# Altium schematic sheet gtp.SchDoc
size A
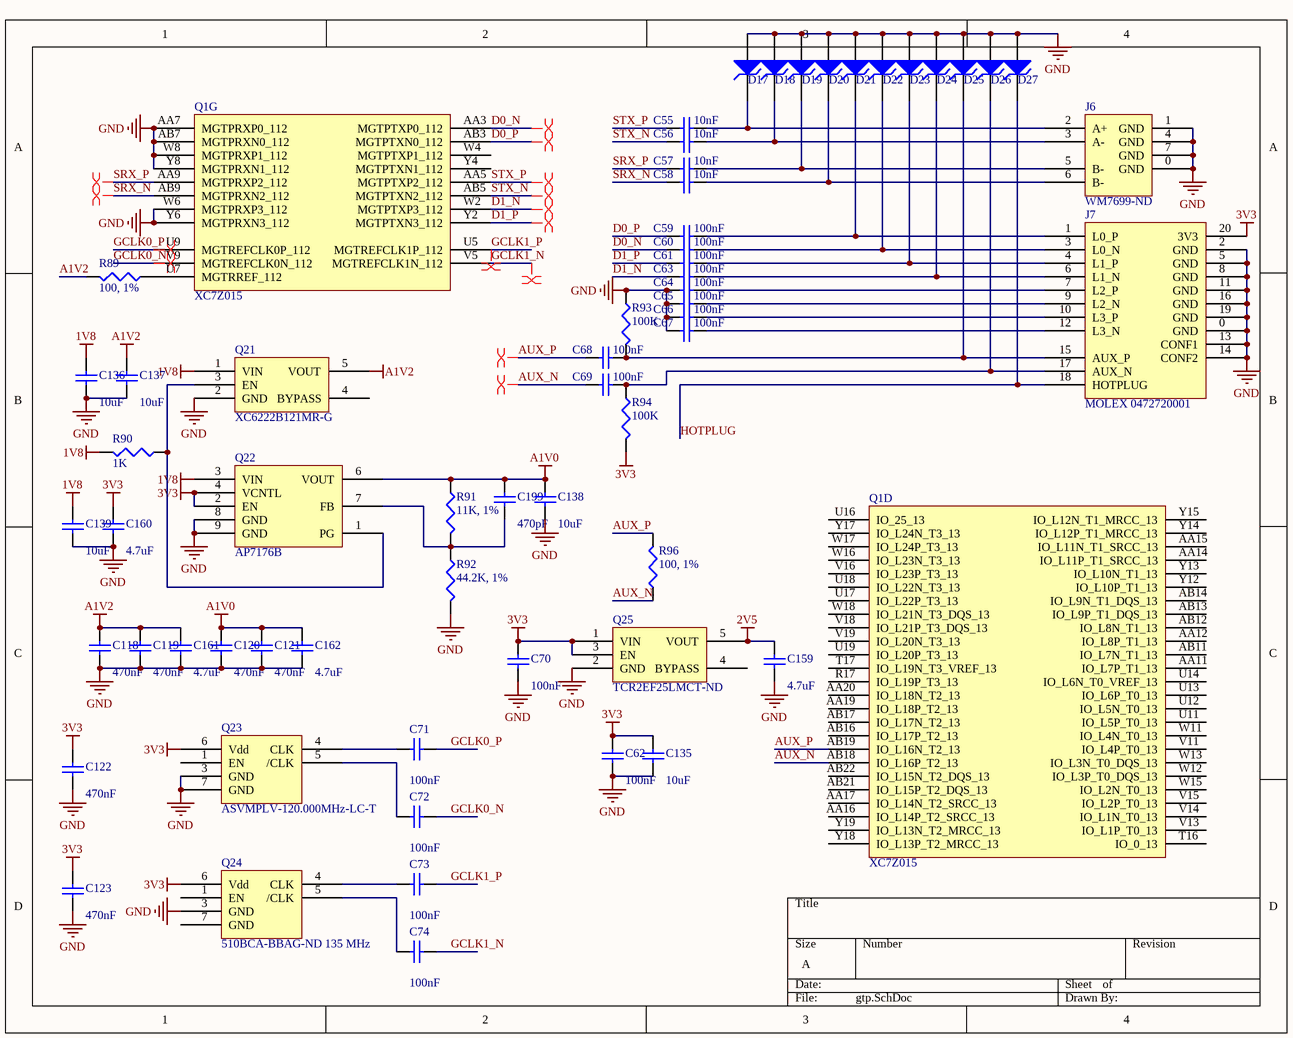
[diagram p0: gtp.SchDoc]

## Parts
C55  value 10nF  [CAPC1005X06L]  (hidden comment: Cap)
C56  value 10nF  [CAPC1005X06L]  (hidden comment: Cap)
C57  value 10nF  [CAPC1005X06L]  (hidden comment: Cap)
C58  value 10nF  [CAPC1005X06L]  (hidden comment: Cap)
C59  value 100nF  [CAPC1005X06L]  (hidden comment: Cap)
C60  value 100nF  [CAPC1005X06L]  (hidden comment: Cap)
C61  value 100nF  [CAPC1005X06L]  (hidden comment: Cap)
C62  value 100nF  [CAPC1005X06L]  (hidden comment: Cap)
C63  value 100nF  [CAPC1005X06L]  (hidden comment: Cap)
C64  value 100nF  [CAPC1005X06L]  (hidden comment: Cap)
C65  value 100nF  [CAPC1005X06L]  (hidden comment: Cap)
C66  value 100nF  [CAPC1005X06L]  (hidden comment: Cap)
C67  value 100nF  [CAPC1005X06L]  (hidden comment: Cap)
C68  value 100nF  [CAPC1005X06L]  (hidden comment: Cap)
C69  value 100nF  [CAPC1005X06L]  (hidden comment: Cap)
C70  value 100nF  [CAPC1005X06L]  (hidden comment: Cap)
C71  value 100nF  [CAPC1005X06L]  (hidden comment: Cap)
C72  value 100nF  [CAPC1005X06L]  (hidden comment: Cap)
C73  value 100nF  [CAPC1005X06L]  (hidden comment: Cap)
C74  value 100nF  [CAPC1005X06L]  (hidden comment: Cap)
C118  value 470nF  [CAPC1005X06L]  (hidden comment: JMK105BJ474KV-F)
C119  value 470nF  [CAPC1005X06L]  (hidden comment: JMK105BJ474KV-F)
C120  value 470nF  [CAPC1005X06L]  (hidden comment: JMK105BJ474KV-F)
C121  value 470nF  [CAPC1005X06L]  (hidden comment: JMK105BJ474KV-F)
C122  value 470nF  [CAPC1005X06L]  (hidden comment: JMK105BJ474KV-F)
C123  value 470nF  [CAPC1005X06L]  (hidden comment: JMK105BJ474KV-F)
C135  value 10uF  [CAPC1608X90N]  (hidden comment: GRM188R60G106ME47)
C136  value 10uF  [CAPC1608X90N]  (hidden comment: GRM188R60G106ME47)
C137  value 10uF  [CAPC1608X90N]  (hidden comment: GRM188R60G106ME47)
C138  value 10uF  [CAPC1608X90N]  (hidden comment: GRM188R60G106ME47)
C139  value 10uF  [CAPC1608X90N]  (hidden comment: GRM188R60G106ME47)
C159  value 4.7uF  [CAPC1608X90N]  (hidden comment: GRM188R60J475ME19D)
C160  value 4.7uF  [CAPC1608X90N]  (hidden comment: GRM188R60J475ME19D)
C161  value 4.7uF  [CAPC1608X90N]  (hidden comment: GRM188R60J475ME19D)
C162  value 4.7uF  [CAPC1608X90N]  (hidden comment: GRM188R60J475ME19D)
C199  value 470pF  [CAPC1608X90N]  (hidden comment: CL10C471JB8NCNC)
D17  EZAEG2A  [CAPC1005X55N]  (value not drawn)
D18  EZAEG2A  [CAPC1005X55N]  (value not drawn)
D19  EZAEG2A  [CAPC1005X55N]  (value not drawn)
D20  EZAEG2A  [CAPC1005X55N]  (value not drawn)
D21  EZAEG2A  [CAPC1005X55N]  (value not drawn)
D22  EZAEG2A  [CAPC1005X55N]  (value not drawn)
D23  EZAEG2A  [CAPC1005X55N]  (value not drawn)
D24  EZAEG2A  [CAPC1005X55N]  (value not drawn)
D25  EZAEG2A  [CAPC1005X55N]  (value not drawn)
D26  EZAEG2A  [CAPC1005X55N]  (value not drawn)
D27  EZAEG2A  [CAPC1005X55N]  (value not drawn)
J6  WM7699-ND  [WM7699-ND]
J7  MOLEX 0472720001  [MOLEX0472720001]
Q1  XC7Z015  [BGA484x22]  (parts D,G of 9)
Q21  XC6222B121MR-G  [SOT23-5]
Q22  AP7176B  [SOIC127P600X135_HS-9N]
Q23  ASVMPLV-120.000MHz-LC-T  [ASVMP]
Q24  510BCA-BBAG-ND 135 MHz  [Si510]
Q25  TCR2EF25LMCT-ND  [SOT23-5]
R89  value 100, 1%  [J1-0603]  (hidden comment: RC1608F101CS)
R90  value 1K  [J1-0603]  (hidden comment: RC1608J102CS)
R91  value 11K, 1%  [J1-0603]  (hidden comment: RC1608F113CS)
R92  value 44.2K, 1%  [J1-0603]  (hidden comment: RC1608F4422CS)
R93  value 100K  [J1-0603]  (hidden comment: RC1608F104CS)
R94  value 100K  [J1-0603]  (hidden comment: RC1608F104CS)
R96  value 100, 1%  [J1-0603]  (hidden comment: RC1608F101CS)

## Nets
1V8: C136.2 C139.2 Q21.1(VIN) Q22.3(VIN) R90.2
2V5: C159.1 Q25.5(VOUT)
3V3: C62.2 C70.2 C122.2 C123.2 C135.2 C160.1 J7.20(3V3) Q22.2(EN) Q22.4(VCNTL) Q23.6(Vdd) Q24.6(Vdd) Q25.1(VIN) Q25.3(EN) R94.2
A1V0: C120.2 C121.2 C138.2 C162.1 C199.1 Q22.6(VOUT) R91.1
A1V2: C118.2 C119.2 C137.2 C161.1 Q21.5(VOUT) R89.2
GND: C62.1 C64.2 C65.2 C66.2 C67.2 C70.1 C118.1 C119.1 C120.1 C121.1 C122.1 C123.1 C135.1 C136.1 C137.1 C138.1 C139.1 C159.2 C160.2 C161.2 C162.2 D17.1(A) D18.1(A) D19.1(A) D20.1(A) D21.1(A) D22.1(A) D23.1(A) D24.1(A) D25.1(A) D26.1(A) D27.1(A) J6.0(GND) J6.1(GND) J6.4(GND) J6.7(GND) J7.0(GND) J7.2(GND) J7.5(GND) J7.8(GND) J7.11(GND) J7.13(CONF1) J7.14(CONF2) J7.16(GND) J7.19(GND) Q1.AA7(MGTPRXP0_112) Q1.AB7(MGTPRXN0_112) Q1.W6(MGTPRXP3_112) Q1.W8(MGTPRXP1_112) Q1.Y6(MGTPRXN3_112) Q1.Y8(MGTPRXN1_112) Q21.2(GND) Q22.8(GND) Q22.9(GND) Q23.3(GND) Q23.7(GND) Q24.3(GND) Q25.2(GND) R92.2 R93.1
AUX_N: C69.2 Q1.AB18(IO_L16P_T2_13) R96.1
AUX_P: C68.2 Q1.AB19(IO_L16N_T2_13) R96.2
D0_N: C60.2 Q1.AA3(MGTPTXP0_112)
D0_P: C59.2 Q1.AB3(MGTPTXN0_112)
D1_N: C63.2 Q1.W2(MGTPTXP3_112)
D1_P: C61.2 Q1.Y2(MGTPTXN3_112)
GCLK0_N: C72.1 Q1.V9(MGTREFCLK0N_112)
GCLK0_P: C71.1 Q1.U9(MGTREFCLK0P_112)
GCLK1_N: C74.1 Q1.V5(MGTREFCLK1N_112)
GCLK1_P: C73.1 Q1.U5(MGTREFCLK1P_112)
HOTPLUG: D27.2(K) J7.18(HOTPLUG)
SRX_N: C58.2 Q1.AB9(MGTPRXN2_112)
SRX_P: C57.2 Q1.AA9(MGTPRXP2_112)
STX_N: C56.2 Q1.AB5(MGTPTXN2_112)
STX_P: C55.2 Q1.AA5(MGTPTXP2_112)
NetC55_1: C55.1 D17.2(K) J6.2(A+)
NetC56_1: C56.1 D18.2(K) J6.3(A-)
NetC57_1: C57.1 D19.2(K) J6.5(B-)
NetC58_1: C58.1 D20.2(K) J6.6(B-)
NetC59_1: C59.1 D21.2(K) J7.1(L0_P)
NetC60_1: C60.1 D22.2(K) J7.3(L0_N)
NetC61_1: C61.1 D23.2(K) J7.4(L1_P)
NetC63_1: C63.1 D24.2(K) J7.6(L1_N)
NetC64_1: C64.1 J7.7(L2_P)
NetC65_1: C65.1 J7.9(L2_N)
NetC66_1: C66.1 J7.10(L3_P)
NetC67_1: C67.1 J7.12(L3_N)
NetC68_1: C68.1 D25.2(K) J7.15(AUX_P) R93.2
NetC69_1: C69.1 D26.2(K) J7.17(AUX_N) R94.1
NetC71_2: C71.2 Q23.4(CLK)
NetC72_2: C72.2 Q23.5(/CLK)
NetC73_2: C73.2 Q24.4(CLK)
NetC74_2: C74.2 Q24.5(/CLK)
NetC199_2: C199.2 Q22.7(FB) R91.2 R92.1
NetQ1_U7: Q1.U7(MGTRREF_112) R89.1
NetQ21_3: Q21.3(EN) Q22.1(PG) R90.1

Not connected (* = marked no-connect by the designer): Q1 AA11(IO_L7P_T1_13) AA12(IO_L8P_T1_13) AA14(IO_L11P_T1_SRCC_13) AA15(IO_L11N_T1_SRCC_13) AA16(IO_L14P_T2_SRCC_13) AA17(IO_L14N_T2_SRCC_13) AA19(IO_L18P_T2_13) AA20(IO_L18N_T2_13) AB11(IO_L7N_T1_13) AB12(IO_L8N_T1_13) AB13(IO_L9P_T1_DQS_13) AB14(IO_L9N_T1_DQS_13) AB16(IO_L17P_T2_13) AB17(IO_L17N_T2_13) AB21(IO_L15P_T2_DQS_13) AB22(IO_L15N_T2_DQS_13) R17(IO_L19P_T3_13) T16(IO_0_13) T17(IO_L19N_T3_VREF_13) U11(IO_L5P_T0_13) U12(IO_L5N_T0_13) U13(IO_L6P_T0_13) U14(IO_L6N_T0_VREF_13) U16(IO_25_13) U17(IO_L22P_T3_13) U18(IO_L22N_T3_13) U19(IO_L20P_T3_13) V11(IO_L4P_T0_13) V13(IO_L1P_T0_13) V14(IO_L1N_T0_13) V15(IO_L2P_T0_13) V16(IO_L23P_T3_13) V18(IO_L21P_T3_DQS_13) V19(IO_L20N_T3_13) W4(MGTPTXP1_112) W11(IO_L4N_T0_13) W12(IO_L3P_T0_DQS_13) W13(IO_L3N_T0_DQS_13) W15(IO_L2N_T0_13) W16(IO_L23N_T3_13) W17(IO_L24P_T3_13) W18(IO_L21N_T3_DQS_13) Y4(MGTPTXN1_112) Y12(IO_L10P_T1_13) Y13(IO_L10N_T1_13) Y14(IO_L12P_T1_MRCC_13) Y15(IO_L12N_T1_MRCC_13) Y17(IO_L24N_T3_13) Y18(IO_L13P_T2_MRCC_13) Y19(IO_L13N_T2_MRCC_13); Q21 4(BYPASS); Q23 1(EN); Q24 1(EN) 7(GND); Q25 4(BYPASS)

## Layout directives
differential pair: AUX_N, AUX_P, D0_N, D0_P, D1_N, D1_P, GCLK0_N, GCLK0_P, GCLK1_N, GCLK1_P, SRX_N, SRX_P, STX_N, STX_P

## Library data of the parts
C55-C74 C118-C123 C135-C139 C159-C162 C199 = Cap: Capacitor; Published: 8-Jun-2000; LatestRevisionDate: 17-Jul-2002; LatestRevisionNote: Re-released for DXP Platform.; PackageReference: RAD-0.3; Publisher: Altium Limited; PackageDescription: Radial Cap, Thru-Hole; 2 Leads; 0.3 in Pin Spacing; Supplier 1: Digi-Key
  C55-C58: Supplier Part Number 1: 490-4516-1-ND
  C59-C74: Supplier Part Number 1: 1276-1443-1-ND
  C118-C123: Supplier Part Number 1: 587-1230-1-ND
  C135-C139: Supplier Part Number 1: 490-3298-1-ND
  C159-C162: Supplier Part Number 1: 490-5421-1-ND
  C199: Supplier Part Number 1: 1276-2302-1-ND
D17-D27 = D Zener: Zener Diode; Published: 8-Jun-2000; LatestRevisionDate: 17-Jul-2002; LatestRevisionNote: Re-released for DXP Platform.; PackageReference: DIODE-0.7; Publisher: Altium Limited; PackageDescription: Diode, Thru-Hole; 2 Leads; 0.7 in Pin Spacing; Supplier 1: Digi-Key; Supplier Part Number 1: P13571CT-ND
J7 = DP: Supplier 1: Digi-Key; Supplier Part Number 1: WM19271CT-ND
Q21 Q25 = LDO: Supplier 1: Digi-Key
  Q21: Supplier Part Number 1: 893-1139-1-ND
  Q25: Supplier Part Number 1: TCR2EF25LM(CTCT-ND
Q23 Q24 = ASVMP: Supplier 1: Digi-Key
  Q23: Supplier Part Number 1: 535-12186-1-ND
  Q24: Supplier Part Number 1: 510BCA-BBAG-ND
R89-R94 R96 = Res3: Resistor; Published: 8-Jun-2000; LatestRevisionDate: 29-May-2009; LatestRevisionNote: IPC-7351 Footprint Added.; PackageReference: J1-0603; Publisher: Altium Limited; PackageDescription: Chip Resistor; Supplier 1: Digi-Key
  R89 R96: Supplier Part Number 1: 1276-3482-1-ND
  R90: Supplier Part Number 1: 1276-5062-1-ND
  R91: Supplier Part Number 1: 1276-4746-1-ND
  R92: Supplier Part Number 1: 1276-4805-1-ND
  R93 R94: Supplier Part Number 1: 1276-3486-1-ND
J6 = WM7699-ND: Supplier 1: Digi-Key; Supplier Part Number 1: WM7699-ND
Q1 = XC7Z015: Supplier 1: Digi-Key; Supplier Part Number 1: 122-1905-ND
Q22 = AP7176B: Supplier 1: Digi-Key; Supplier Part Number 1: AP7176BSP-13DICT-ND